# EAGLE schematic FRDM-Bare (EAGLE 8.6.0)

## Sheet 1 of 5: FRDM shield pinout
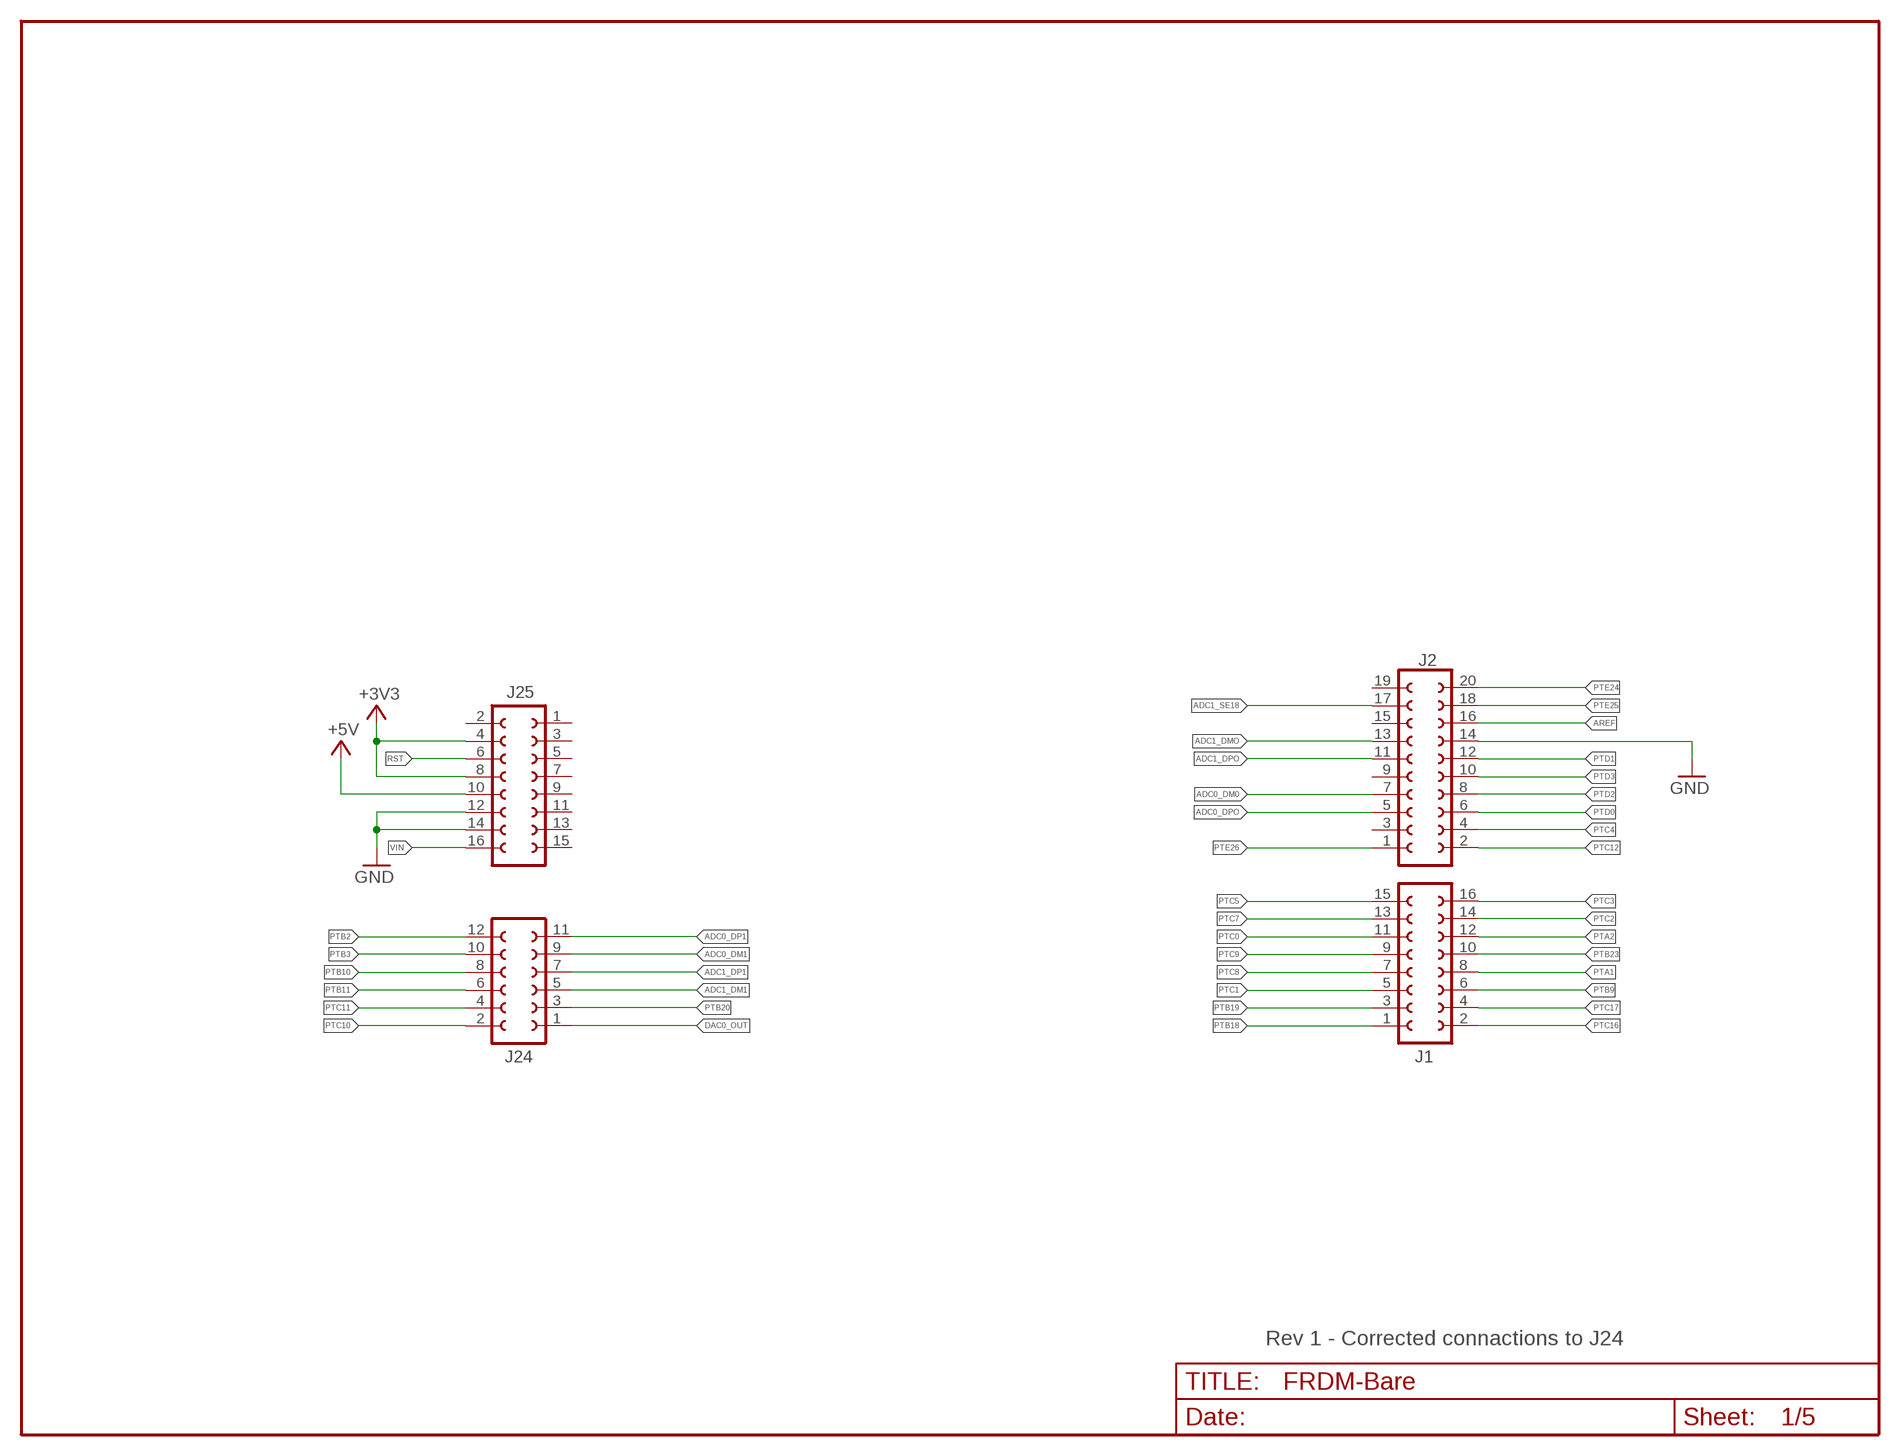
[diagram p0: schematic, sheet 1]

### Parts
J1  FE08-2  [FE08-2]
J2  FE10-2  [FE10-2]
J24  FE06-2  [FE06-2]
J25  FE08-2  [FE08-2]

### Nets
+3V3: J25.4 J25.8
+5V [usbvcc]: J25.10
ADC0_DM0: J2.7
ADC0_DM1: J24.9
ADC0_DP1: J24.11
ADC0_DPO: J2.5
ADC1_DM1: J24.5
ADC1_DMO: J2.13
ADC1_DP1: J24.7
ADC1_DPO: J2.11
ADC1_SE18: J2.17
AREF [aref]: J2.16
DAC0_OUT: J24.1
GND [gnd]: J2.14 J25.12 J25.14
PTA1: J1.8
PTA2: J1.12
PTB2: J24.12
PTB3: J24.10
PTB9: J1.6
PTB10: J24.8
PTB11: J24.6
PTB18: J1.1
PTB19: J1.3
PTB20: J24.3
PTB23: J1.10
PTC0: J1.11
PTC1: J1.5
PTC2: J1.14
PTC3: J1.16
PTC4: J2.4
PTC5: J1.15
PTC7: J1.13
PTC8: J1.7
PTC9: J1.9
PTC10: J24.2
PTC11: J24.4
PTC12: J2.2
PTC16: J1.2
PTC17: J1.4
PTD0: J2.6
PTD1: J2.12
PTD2: J2.8
PTD3: J2.10
PTE24: J2.20
PTE25: J2.18
PTE26: J2.1
RST: J25.6
VIN: J25.16
Unconnected: J2.3 J2.9 J2.15 J2.19 J25.1 J25.2 J25.3 J25.5 J25.7 J25.9 J25.11 J25.13 J25.15

### Notes on the sheet
- Rev 1 - Corrected connactions to J24

## Sheet 2 of 5: MMA8452Q accelerometer
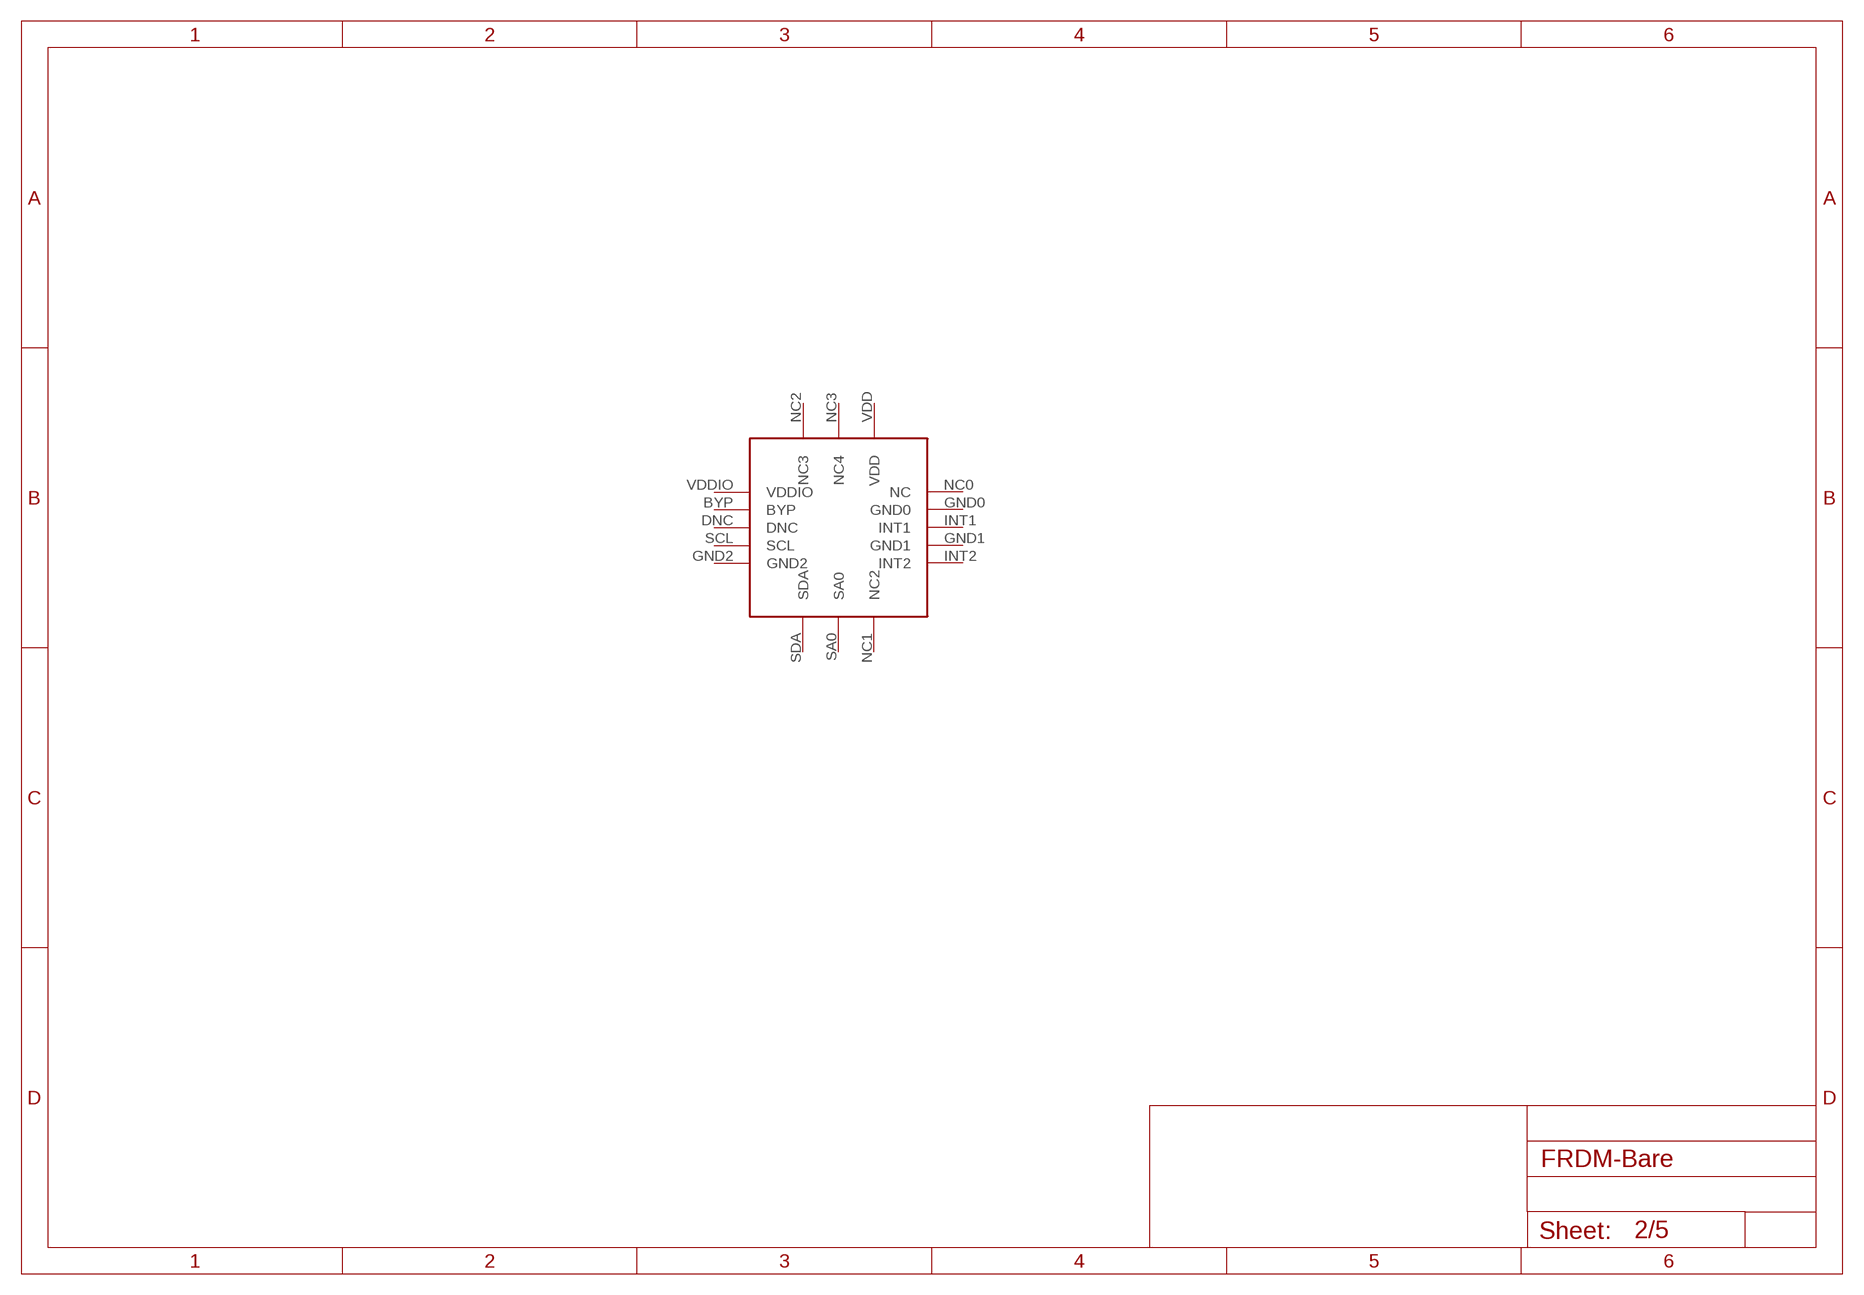
[diagram p1: schematic, sheet 2]

### Parts
U$1  MMA8452Q  [QFNPIN16]
Unconnected: U$1.BYP U$1.DNC U$1.GND0 U$1.GND1 U$1.GND2 U$1.INT1 U$1.INT2 U$1.NC0(NC) U$1.NC1(NC2) U$1.NC2(NC3) U$1.NC3(NC4) U$1.SA0 U$1.SCL U$1.SDA U$1.VDD U$1.VDDIO

## Sheet 3 of 5: SARA-N2 NB-Iot-module
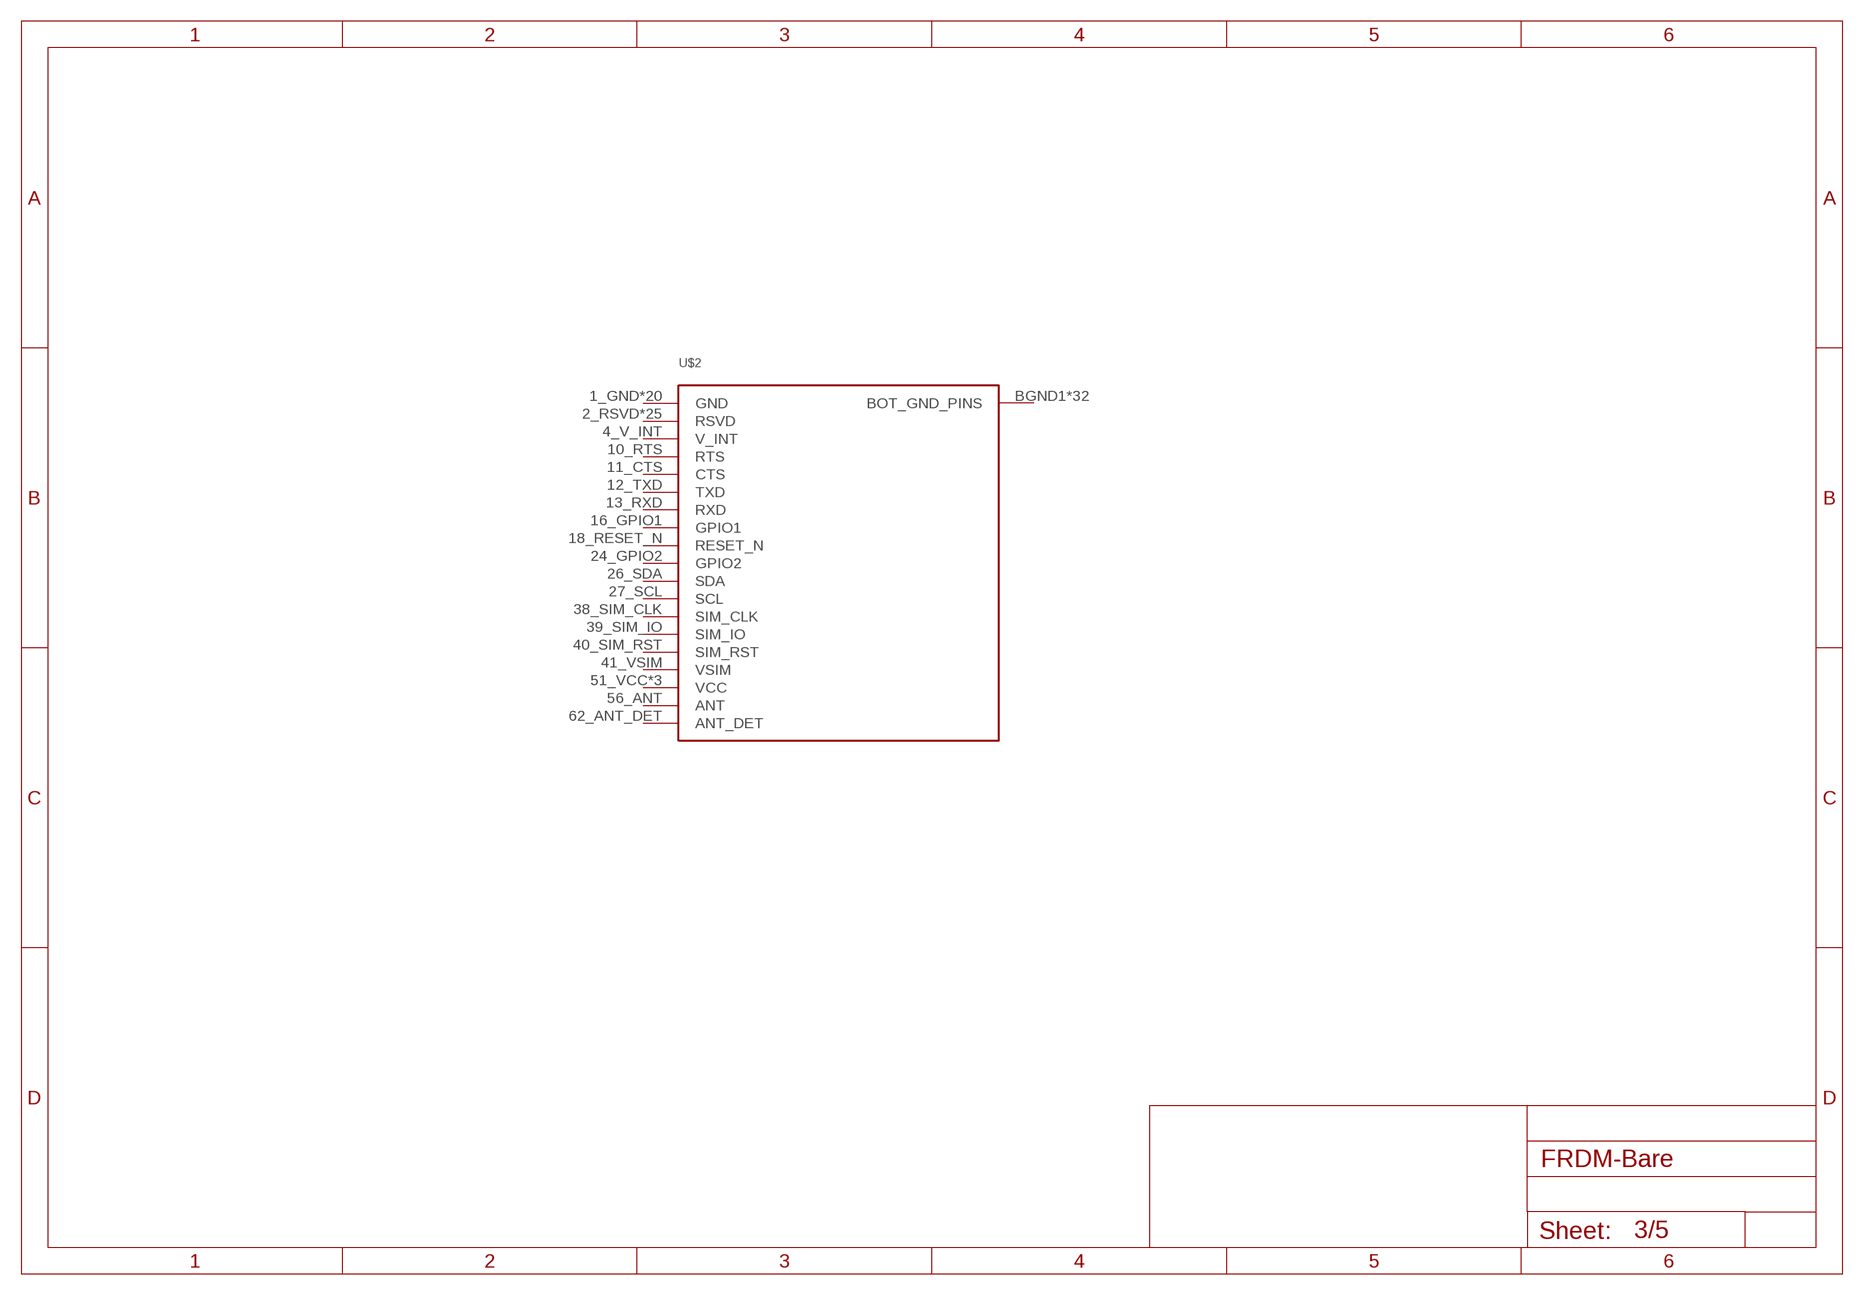
[diagram p2: schematic, sheet 3]

### Parts
U$2  SARA-N2  [SARA-N2]
Unconnected: U$2.1_GND(GND) U$2.2_RSVD(RSVD) U$2.3_GND(GND) U$2.4_V_INT(V_INT) U$2.5_GND(GND) U$2.6_RSVD(RSVD) U$2.7_RSVD(RSVD) U$2.8_RSVD(RSVD) U$2.9_RSVD(RSVD) U$2.10_RTS(RTS) U$2.11_CTS(CTS) U$2.12_TXD(TXD) U$2.13_RXD(RXD) U$2.14_GND(GND) U$2.15_RSVD(RSVD) U$2.16_GPIO1(GPIO1) U$2.17_RSVD(RSVD) U$2.18_RESET_N(RESET_N) U$2.19_RSVD(RSVD) U$2.20_GND(GND) U$2.21_GND(GND) U$2.22_GND(GND) U$2.23_RSVD(RSVD) U$2.24_GPIO2(GPIO2) U$2.25_RSVD(RSVD) U$2.26_SDA(SDA) U$2.27_SCL(SCL) U$2.28_RSVD(RSVD) U$2.29_RSVD(RSVD) U$2.30_GND(GND) U$2.31_RSVD(RSVD) U$2.32_GND(GND) U$2.33_RSVD(RSVD) U$2.34_RSVD(RSVD) U$2.35_RSVD(RSVD) U$2.36_RSVD(RSVD) U$2.37_RSVD(RSVD) U$2.38_SIM_CLK(SIM_CLK) U$2.39_SIM_IO(SIM_IO) U$2.40_SIM_RST(SIM_RST) U$2.41_VSIM(VSIM) U$2.42_RSVD(RSVD) U$2.43_GND(GND) U$2.44_RSVD(RSVD) U$2.45_RSVD(RSVD) U$2.46_RSVD(RSVD) U$2.47_RSVD(RSVD) U$2.48_RSVD(RSVD) U$2.49_RSVD(RSVD) U$2.50_GND(GND) U$2.51_VCC(VCC) U$2.52_VCC(VCC) U$2.53_VCC(VCC) U$2.54_GND(GND) U$2.55_GND(GND) U$2.56_ANT(ANT) U$2.57_GND(GND) U$2.58_GND(GND) U$2.59_GND(GND) U$2.60_GND(GND) U$2.61_GND(GND) U$2.62_ANT_DET(ANT_DET) U$2.63_GND(GND) U$2.64_GND(GND) U$2.BGND1(BOT_GND_PINS) U$2.BGND2(BOT_GND_PINS) U$2.BGND3(BOT_GND_PINS) U$2.BGND4(BOT_GND_PINS) U$2.BGND5(BOT_GND_PINS) U$2.BGND6(BOT_GND_PINS) U$2.BGND7(BOT_GND_PINS) U$2.BGND8(BOT_GND_PINS) U$2.BGND9(BOT_GND_PINS) U$2.BGND10(BOT_GND_PINS) U$2.BGND11(BOT_GND_PINS) U$2.BGND12(BOT_GND_PINS) U$2.BGND13(BOT_GND_PINS) U$2.BGND14(BOT_GND_PINS) U$2.BGND15(BOT_GND_PINS) U$2.BGND16(BOT_GND_PINS) U$2.BGND17(BOT_GND_PINS) U$2.BGND18(BOT_GND_PINS) U$2.BGND19(BOT_GND_PINS) U$2.BGND20(BOT_GND_PINS) U$2.BGND21(BOT_GND_PINS) U$2.BGND22(BOT_GND_PINS) U$2.BGND23(BOT_GND_PINS) U$2.BGND24(BOT_GND_PINS) U$2.BGND25(BOT_GND_PINS) U$2.BGND26(BOT_GND_PINS) U$2.BGND27(BOT_GND_PINS) U$2.BGND28(BOT_GND_PINS) U$2.BGND29(BOT_GND_PINS) U$2.BGND30(BOT_GND_PINS) U$2.BGND31(BOT_GND_PINS) U$2.BGND32(BOT_GND_PINS)

## Sheet 4 of 5: GPS-module
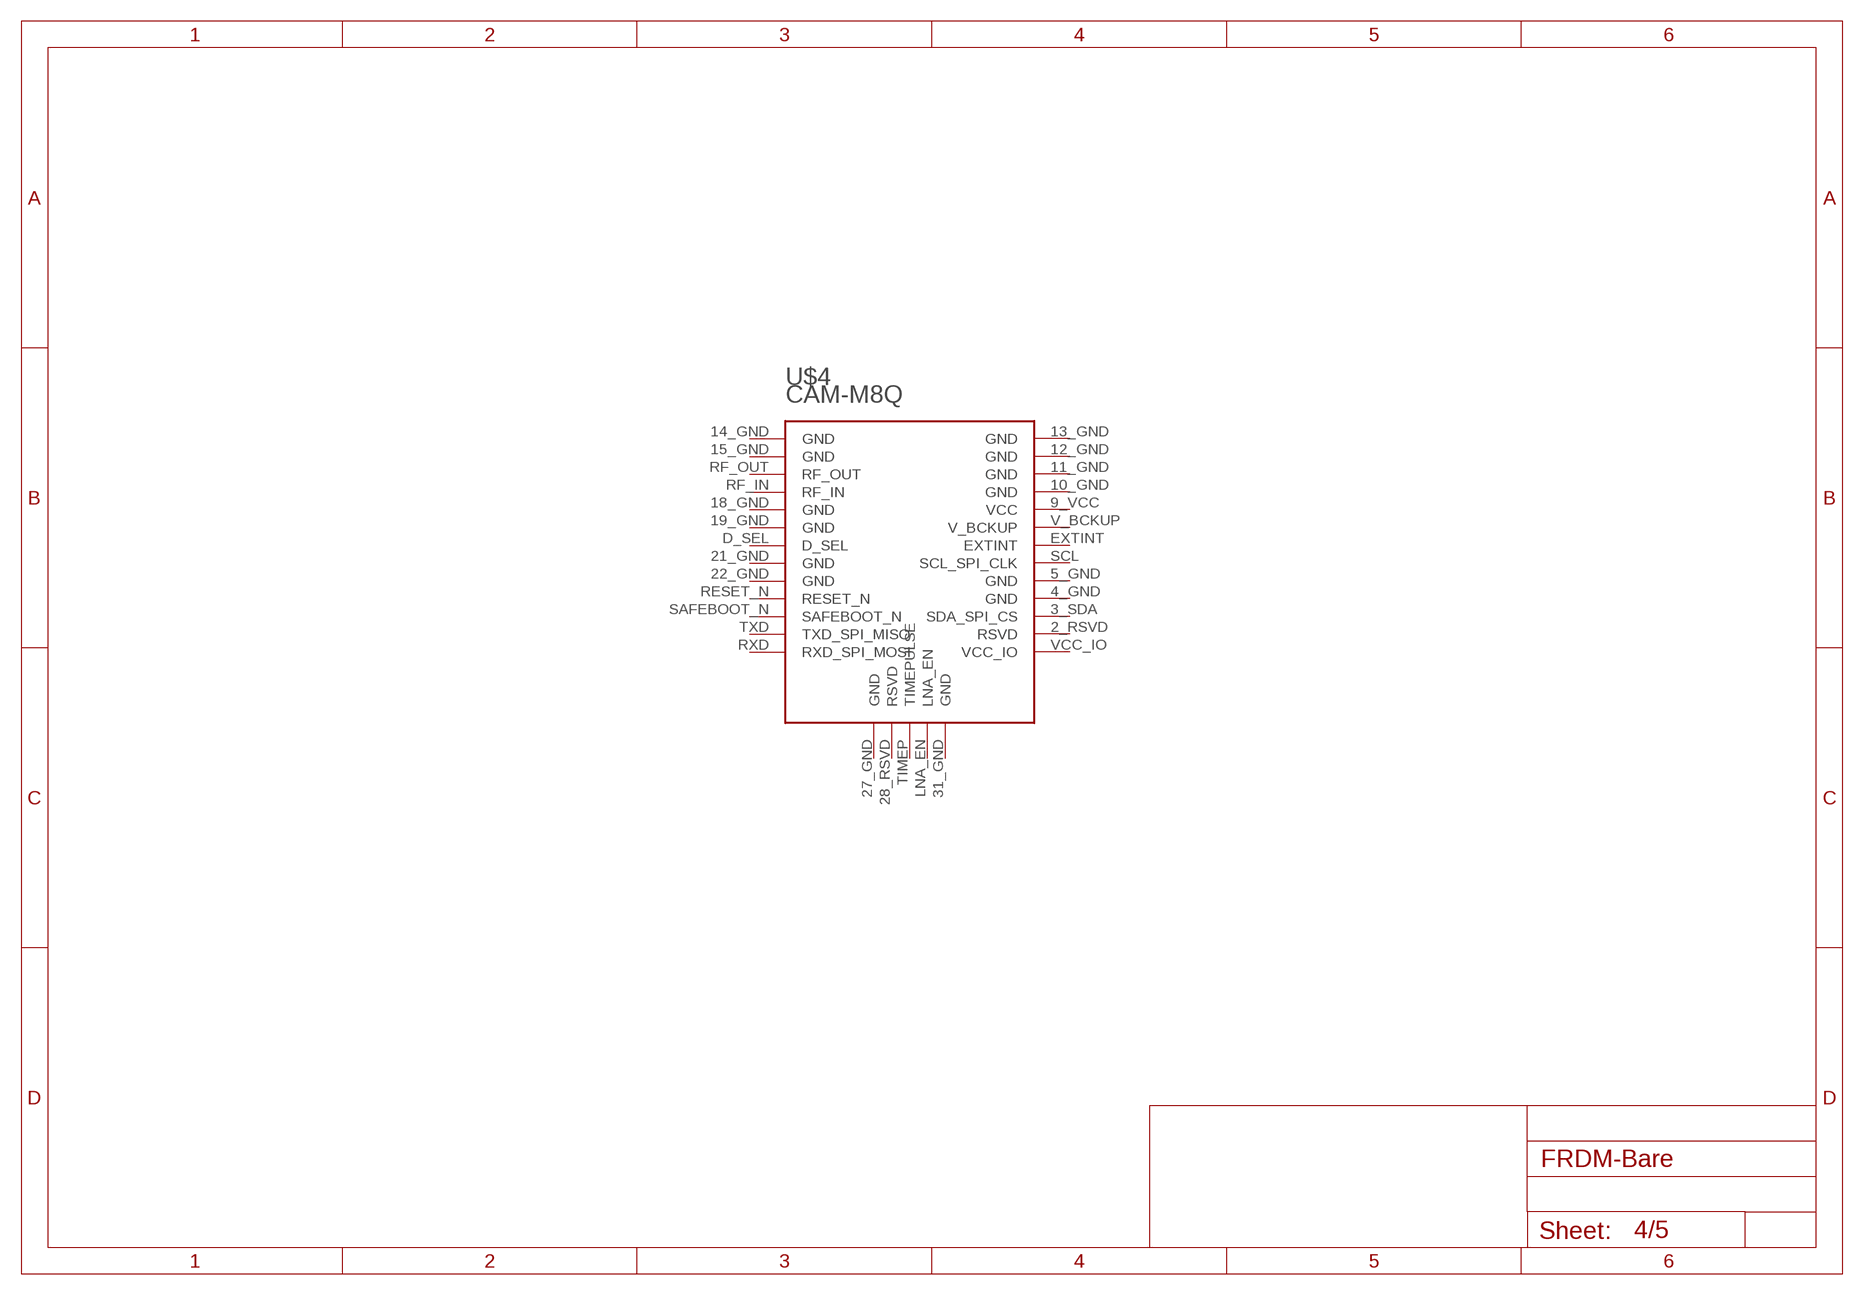
[diagram p3: schematic, sheet 4]

### Parts
U$4  CAM-M8Q  [CAM-M8Q]
Unconnected: U$4.2_RSVD(RSVD) U$4.3_SDA(SDA_SPI_CS) U$4.4_GND(GND) U$4.5_GND(GND) U$4.9_VCC(VCC) U$4.10_GND(GND) U$4.11_GND(GND) U$4.12_GND(GND) U$4.13_GND(GND) U$4.14_GND(GND) U$4.15_GND(GND) U$4.18_GND(GND) U$4.19_GND(GND) U$4.21_GND(GND) U$4.22_GND(GND) U$4.27_GND(GND) U$4.28_RSVD(RSVD) U$4.31_GND(GND) U$4.D_SEL U$4.EXTINT U$4.LNA_EN U$4.RESET_N U$4.RF_IN U$4.RF_OUT U$4.RXD(RXD_SPI_MOSI) U$4.SAFEBOOT_N U$4.SCL(SCL_SPI_CLK) U$4.TIMEP(TIMEPULSE) U$4.TXD(TXD_SPI_MISO) U$4.V_BCKUP U$4.VCC_IO

## Sheet 5 of 5: Power regulator schematic
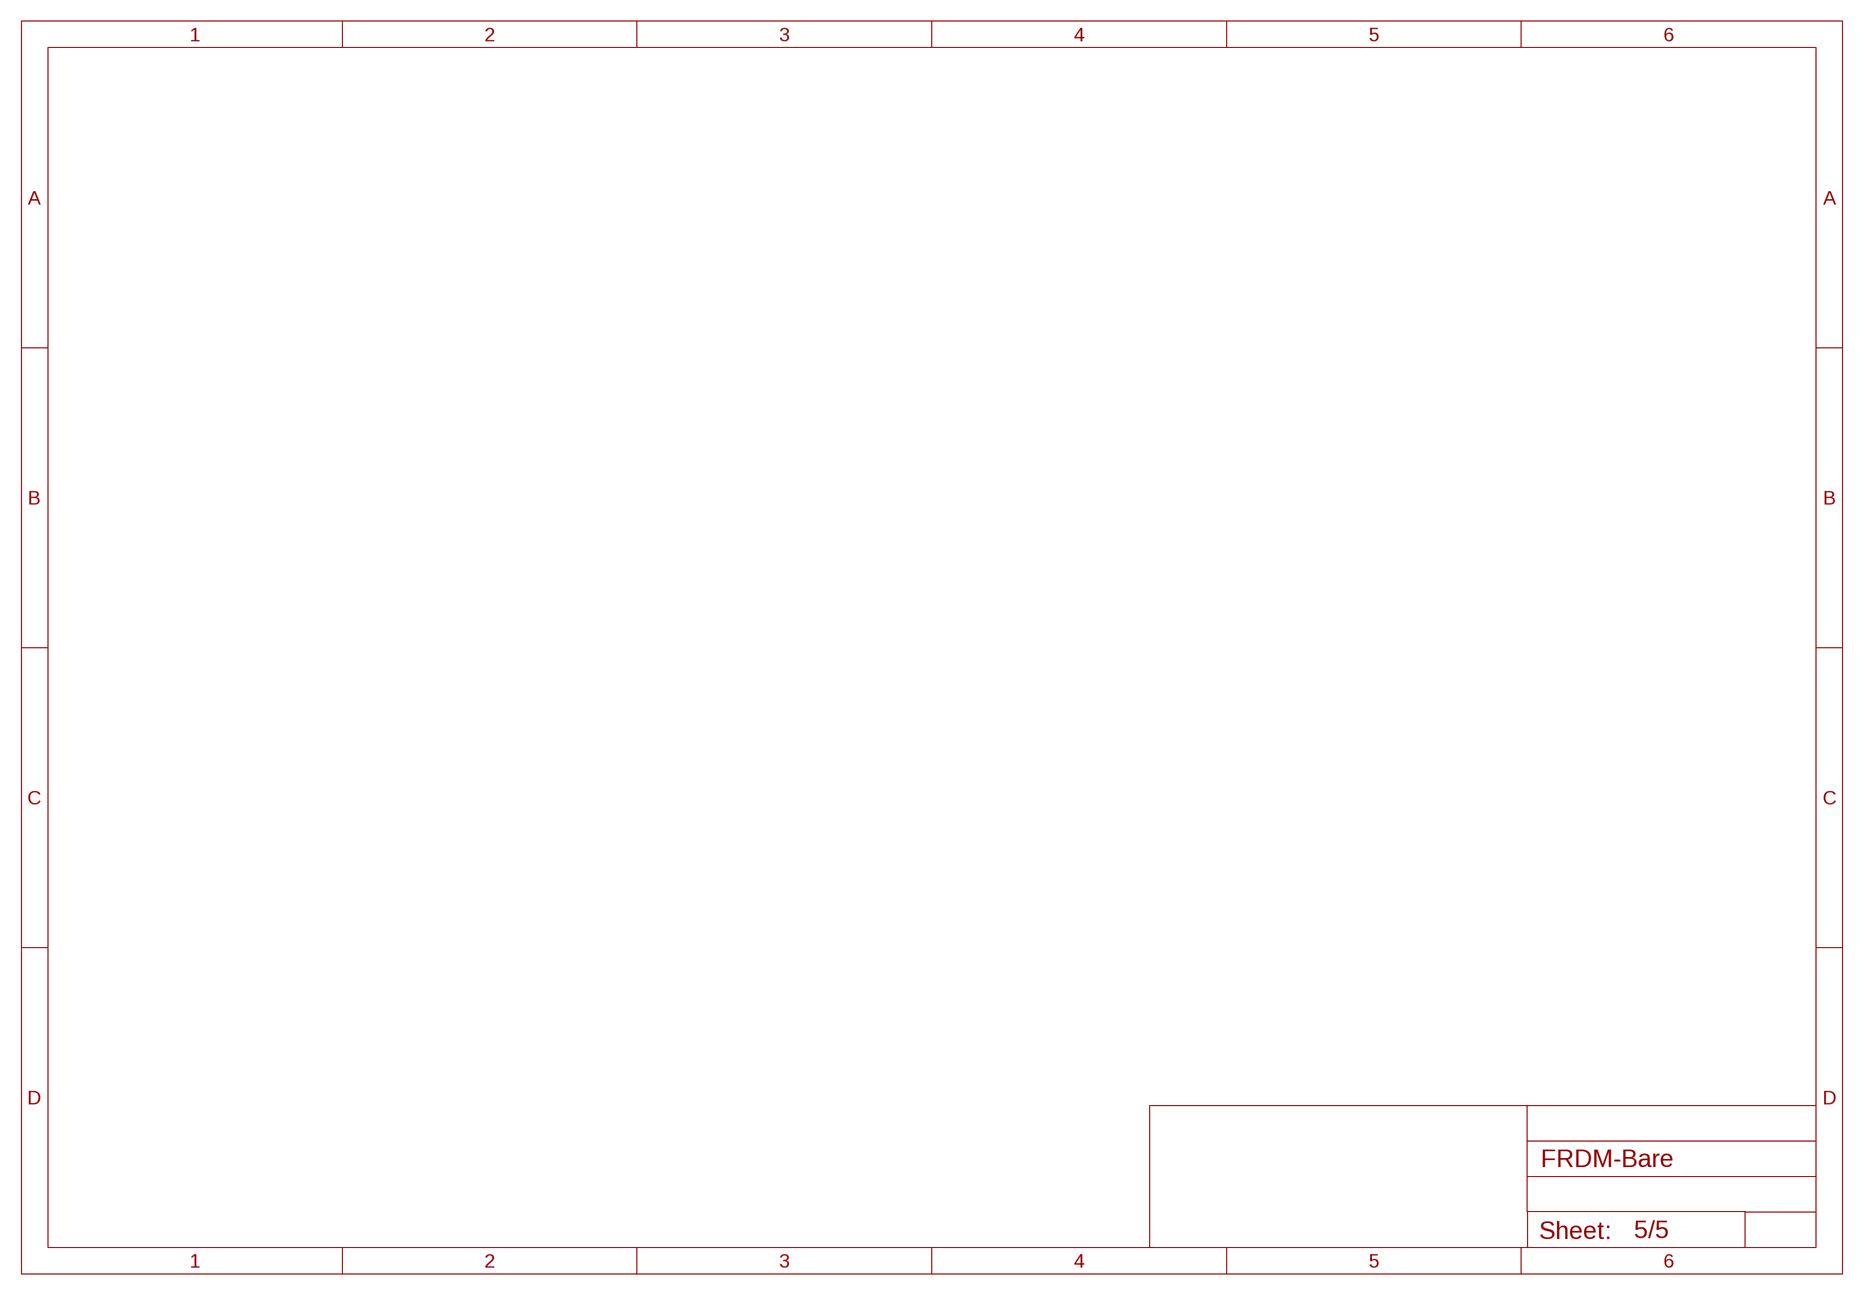
[diagram p4: schematic, sheet 5]

## Library data of the parts
J1 J25 = con-lsta:FE08-2: FEMALE HEADER; OC_FARNELL: unknown; OC_NEWARK: unknown
J2 = con-lsta:FE10-2: FEMALE HEADER; OC_FARNELL: unknown; OC_NEWARK: unknown
J24 = con-lsta:FE06-2: FEMALE HEADER; OC_FARNELL: unknown; OC_NEWARK: unknown
U$1 = MMA8452Q:MMA8452Q
U$2 = trackerlib:SARA-N2
U$4 = trackerlib:CAM-M8Q

## Net classes
0 default: width 0.254 mm, clearance 0.254 mm
1 power: width 0.61 mm, drill 0.61 mm, clearance 0.254 mm
2 gnd: width 0.305 mm, drill 0.559 mm, clearance 0.254 mm
3 usbvcc: width 0.508 mm, drill 0.61 mm, clearance 0.254 mm
4 aref: width 0.406 mm, drill 0.61 mm, clearance 0.254 mm